# EAGLE design stamp-fixed-smt-mk-1.0 (EAGLE 7.5.0)
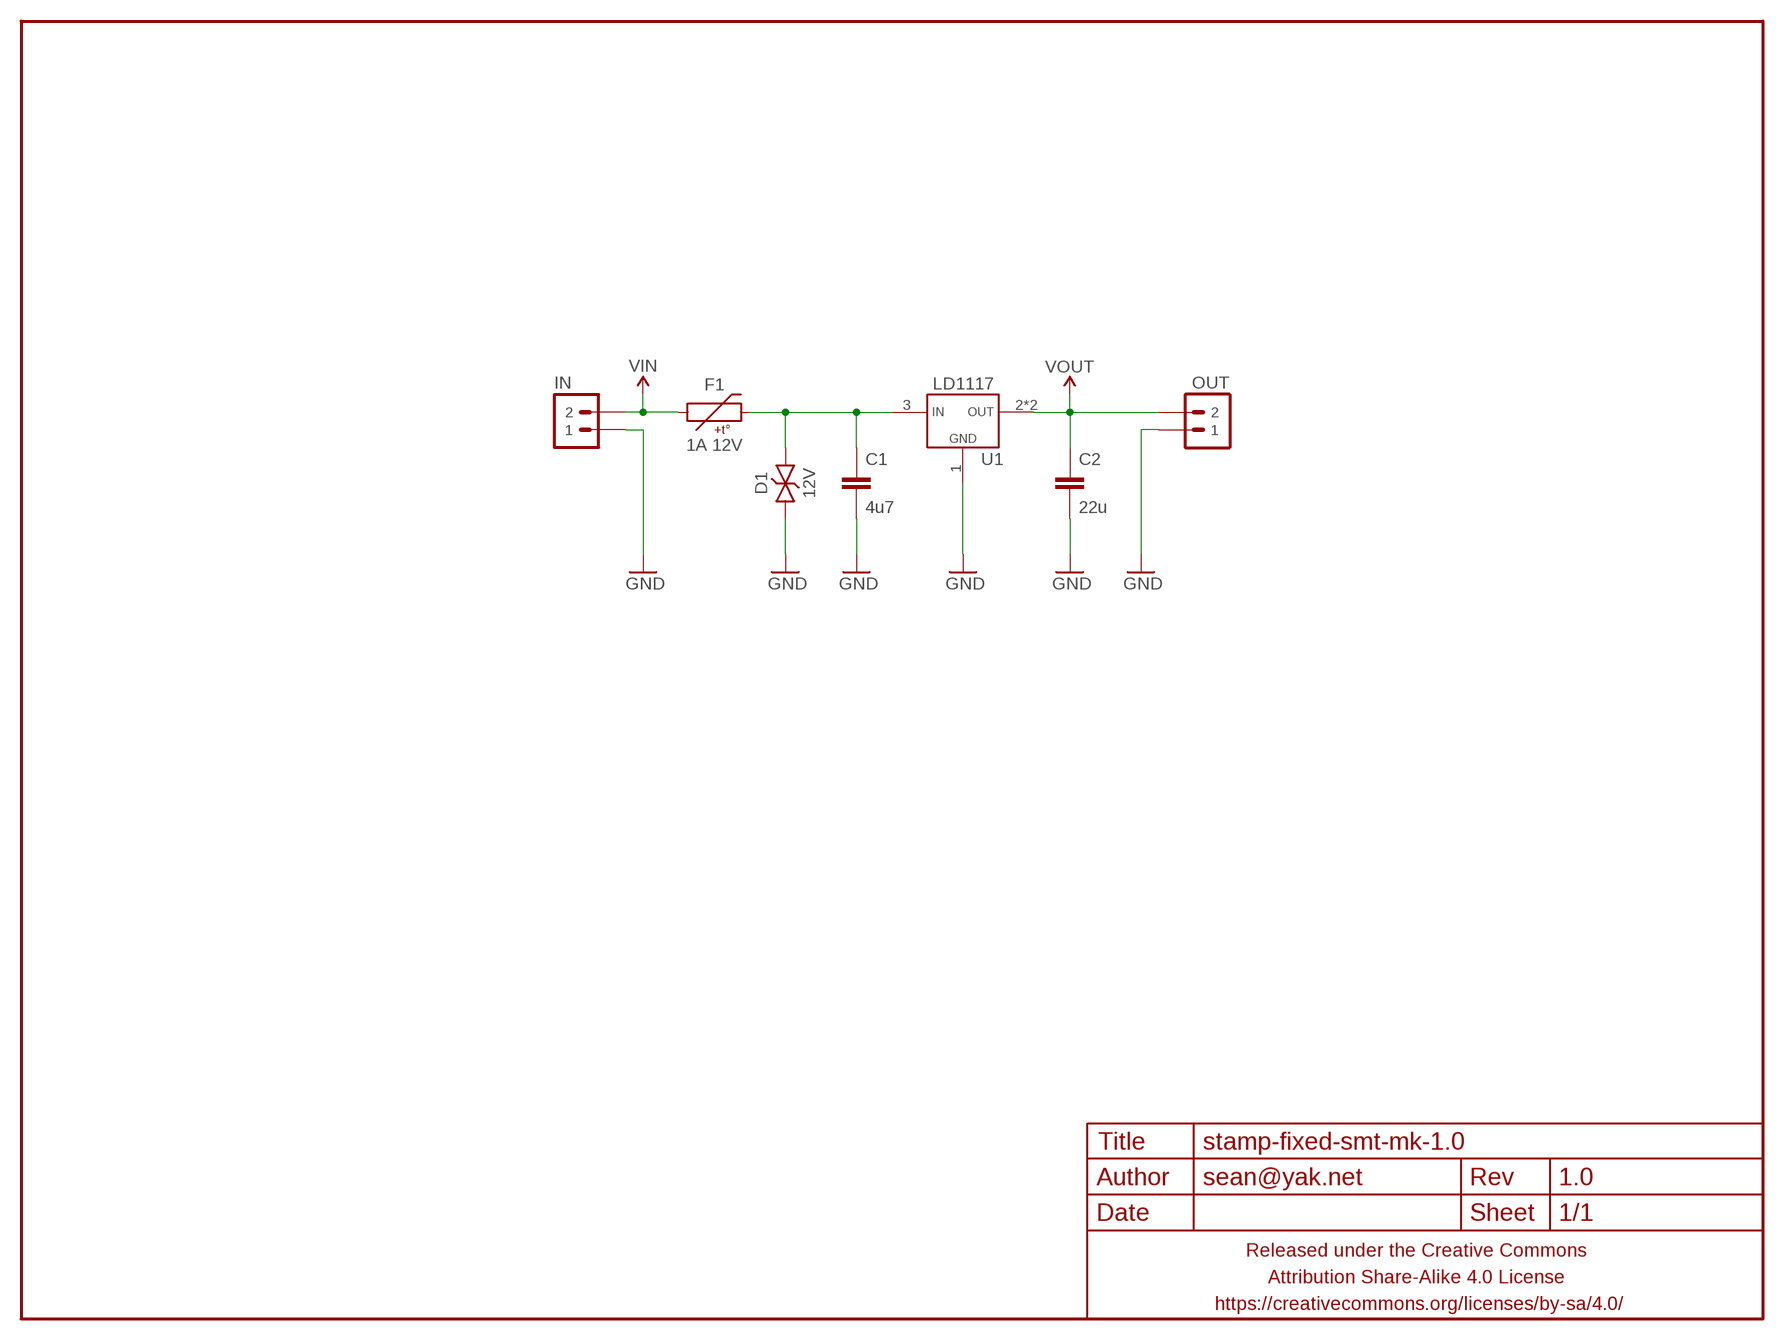
[diagram p0: schematic, sheet 1]

## Parts
C1  4u7  CAPACITOR-CERAMICC0805-TIGHTER  [C0805-TIGHTER]
C2  22u  CAPACITOR-CERAMICC0805-TIGHTER  [C0805-TIGHTER]
D1  12V  TVSSOD323  [SOD323-TVS-BIDIR]
F1  1A 12V  PTCSMD  [PTC-1206]
FRAME1  FRAME-LETTERNO_PACKAGE  [DUMMY]
IN  M02PTH-CENTERED-R+  [1X02-CENTER-R+]
OUT  M02PTH-CENTERED-R+  [1X02-CENTER-R+]
U1  LD1117  VREG_1117SOT223  [SOT223]

## Nets
GND: C1.2 C2.2 D1.A IN.1 OUT.1 U1.1(GND)
N$2: C1.1 D1.C F1.2 U1.3(VIN)
VIN: F1.1 IN.2
VOUT: C2.1 OUT.2 U1.2(VOUT) U1.4(VOUT)

## Library data of the parts
C1 C2 = a_parts:CAPACITOR-CERAMIC: CAPACITOR, European symbol
D1 = a_parts:TVS: Transient voltage suppressor- prevents ESD on inputs. Ignore package description- MBRA140 is NOT this type of part!!!
F1 = a_parts:PTC: Resettable Fuse PTC Resettable Fuse. Spark Fun Electronics SKU : COM-08357; PROD_ID: RES-11150
FRAME1 = a_parts:FRAME-LETTER: Schematic Frame Standard 8.5x11 US Letter frame; DESIGNER: sean@yak.net; VERSION: 1.0
IN OUT = a_parts:M02: Standard 2-pin 0.1" header. Use with - straight break away headers ( PRT-00116) - right angle break away headers (PRT-00553) - swiss pins (PRT-00743) - machine pins (PRT-00117) - female headers (PRT-00115) Molex polarized connector foot print use with: PRT-08233 with associated crimp pins and housings. 2.54_SCREWTERM for use with PRT-10571. 3.5mm Screw Terminal footprints for PRT-08084 5mm Screw Terminal footprints for use with PRT-08433
U1 = a_parts:VREG_1117

## Board
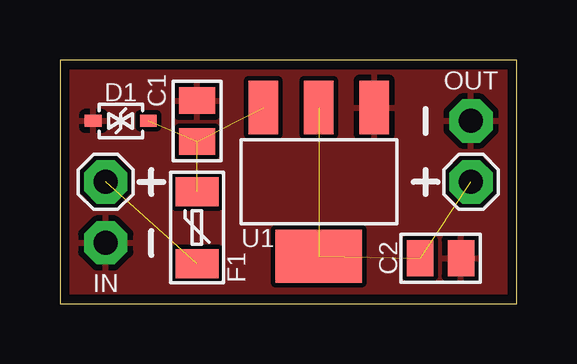
[diagram p1: board, top side]

Size 19.05 x 10.16 mm. Coordinates in mm from the lower left corner, seen from the top.
Outline: 0,10.16 0,0 19.05,0 19.05,10.16 0,10.16
Copper layers (1*16): Top 0.0356mm / dielectric 1.5011mm / Bottom 0.0356mm
Design rules "LaenPCBOrder2": minimum track width 6mil, minimum drill 13mil, track to track 6mil, track to pad 6mil, pad to pad 6mil, via to via 6mil, smd to smd 6mil, copper to edge 15mil, drill to drill 6mil, minimum pad ring 7mil, minimum via ring 7mil, stop-mask expansion 3mil, vias tented up to drill 20mil, thermal gap 10mil

### Footprints (pad centres in the part's own frame; a part is rotated, then mirrored left to right if it is on the bottom)
C0805-TIGHTER = smd 1.1 x 1.5: 1 -0.85,0; 2 0.85,0
SOD323-TVS-BIDIR = smd 0.7 x 0.5: A -1.15,0; C 1.15,0
PTC-1206 = smd 1.2 x 1.8: 1 -1.5,0; 2 1.5,0
1X02-CENTER-R+ = drill 1 pad 1.8 octagon: 1 -1.27,0; 2 1.27,0
SOT223 = smd 1.219 x 2.235: 1 -2.311,-3.099; 2 0,-3.099; 3 2.311,-3.099 | smd 3.6 x 2.2: 4 0,3.099

### Placement (x,y rotation side)
C1  5.71,7.62 90 top
C2  15.88,1.91 0 top
D1  2.54,7.62 0 top
F1  5.71,3.17 90 top
FRAME1  0,0 0 top
IN  1.91,3.81 90 top
OUT  17.14,6.35 270 top
U1  10.79,5.08 180 top

### Tracks (layer width: path | path; a pad name or v marks a point on that pad's centre or on a via)
GND
  pour Top (isolate 0.2): 0,0 19.05,0 19.05,10.16 0,10.16
N$2  (3 unrouted)
VIN  (1 unrouted)
VOUT  (3 unrouted)